# EAGLE design openSX70-usb-charger (EAGLE 9.2.0)
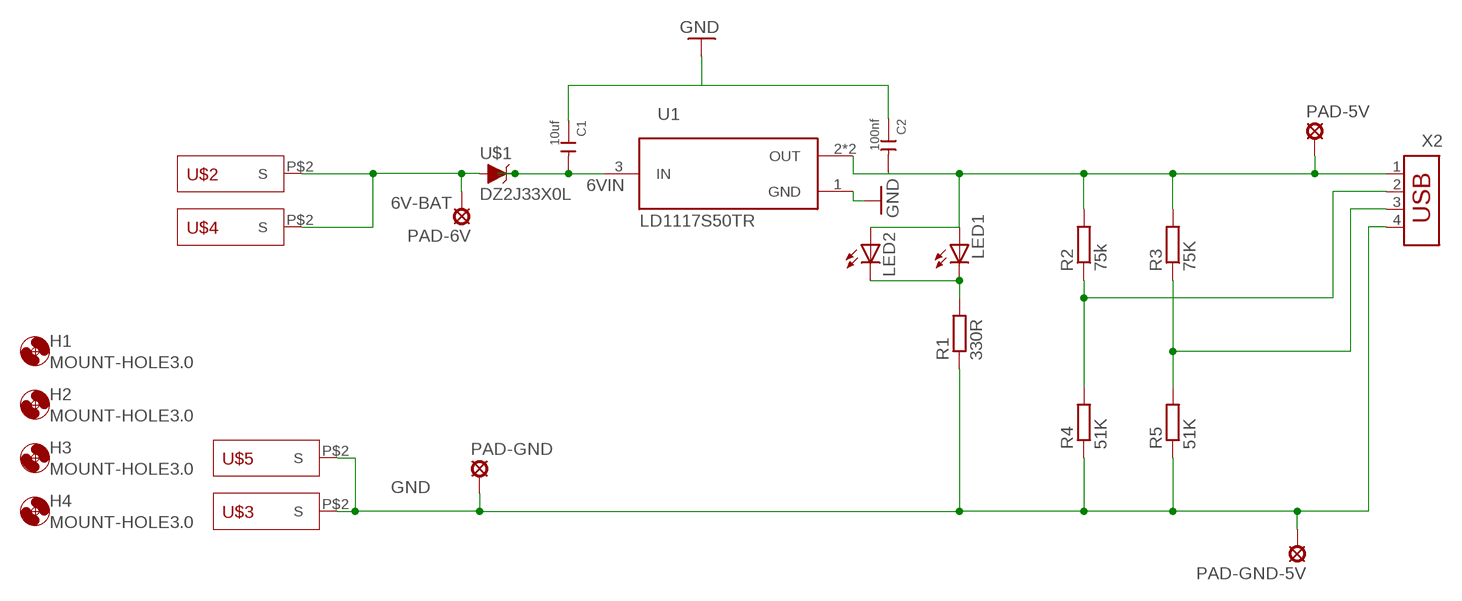
[diagram p0: schematic, sheet 1]

## Parts
C1  10uf  CERAMIC-10UF-10V-10%-X5R(0603)  [C0603]
C2  100nf  CERAMIC-100NF-50V-10%-X7R(0603)  [C0603]
H1  MOUNT-HOLE3.0  [3,0]
H2  MOUNT-HOLE3.0  [3,0]
H3  MOUNT-HOLE3.0  [3,0]
H4  MOUNT-HOLE3.0  [3,0]
LED1  LED5MM  [LED5MM]
LED2  LEDCHIPLED_0805  [CHIPLED_0805]
PAD-5V  LSP13  [LSP13]
PAD-6V  LSP13  [LSP13]
PAD-GND  LSP13  [LSP13]
PAD-GND-5V  LSP13  [LSP13]
R1  330R  R-EU_R0603  [R0603]
R2  75k  R-EU_R0603  [R0603]
R3  75K  R-EU_R0603  [R0603]
R4  51K  R-EU_R0603  [R0603]
R5  51K  R-EU_R0603  [R0603]
U1  LD1117S50TR  [LD1117S50TR_SOT230P700X180-4N]
U$1  DZ2J33X0L  [SMINI2]
U$2  BATTERY-PAD  [BATTERY-PAD]
U$3  BATTERY-PAD  [BATTERY-PAD]
U$4  BATTERY-PAD  [BATTERY-PAD]
U$5  BATTERY-PAD  [BATTERY-PAD]
X2  USB-787616  [USB]

## Nets
6V-BAT: PAD-6V.MP U$1.P$2(A) U$2.P$2(S) U$4.P$2(S)
6VIN: C1.2 U1.3(IN) U$1.P$1(C)
GND: C1.1 C2.1 PAD-GND-5V.MP PAD-GND.MP R1.1 R4.1 R5.1 U1.1(GND) U$3.P$2(S) U$5.P$2(S) X2.4
N$1: LED1.K(C) LED2.C R1.2
N$2: C2.2 LED1.A LED2.A PAD-5V.MP R2.2 R3.2 U1.2(OUT) U1.4(OUT) X2.1
N$3: R2.1 R4.2 X2.2
N$5: R3.1 R5.2 X2.3

## Library data of the parts
C1 = Seeed-Capacitor:CERAMIC-10UF-10V-10%-X5R(0603): 302010103; MPN: CC0603KRX5R6BB106
C2 = Seeed-Capacitor:CERAMIC-100NF-50V-10%-X7R(0603): 302010138; MPN: CC0603KRX7R9BB104
H1-H4 = holes:MOUNT-HOLE: MOUNTING HOLE with drill center marker
LED1 LED2 = led:LED: LED OSRAM: - CHIPLED LG R971, LG N971, LY N971, LG Q971, LY Q971, LO R971, LY R971 LH N974, LH R974 LS Q976, LO Q976, LY Q976 LO Q996 - Hyper CHIPLED LW Q18S LB Q993, LB Q99A, LB R99A - SideLED LS A670, LO A670, LY A670, LG A670, LP A670 LB A673, LV A673, LT A673, LW A673 LH A674 LY A675 LS A676, LA A676, LO A676, LY A676, LW A676 LS A679, LY A679, LG A679 - Hyper Micro SIDELED® LS Y876, LA Y876, LO Y876, LY Y876 LT Y87S - SmartLED LW L88C, LW L88S LB L89C, LB L89S, LG L890 LS L89K, LO L89K, LY L89K LS L896, LA L896, LO L896, LY L896 - TOPLED LS T670, LO T670, LY T670, LG T670, LP T670 LSG T670, LSP T670, LSY T670, LOP T670, LYG T670 LG T671, LOG T671, LSG T671 LB T673, LV T673, LT T673, LW T673 LH T674 LS T676, LA T676, LO T676, LY T676, LB T676, LH T676, LSB T676, LW T676 LB T67C, LV T67C, LT T67C, LS T67K, LO T67K, LY T67K, LW E67C LS E67B, LA E67B, LO E67B, LY E67B, LB E67C, LV E67C, LT E67C LW T67C LS T679, LY T679, LG T679 LS T770, LO T770, LY T770, LG T770, LP T770 LB T773, LV T773, LT T773, LW T773 LH T774 LS E675, LA E675, LY E675, LS T675 LS T776, LA T776, LO T776, LY T776, LB T776 LHGB T686 LT T68C, LB T68C - Hyper Mini TOPLED® LB M676 - Mini TOPLED Santana® LG M470 LS M47K, LO M47K, LY M47K Source: http://www.osram.convergy.de LUXEON: - LUMILED® LXK2-PW12-R00, LXK2-PW12-S00, LXK2-PW14-U00, LXK2-PW14-V00 LXK2-PM12-R00, LXK2-PM12-S00, LXK2-PM14-U00 LXK2-PE12-Q00, LXK2-PE12-R00, LXK2-PE12-S00, LXK2-PE14-T00, LXK2-PE14-U00 LXK2-PB12-K00, LXK2-PB12-L00, LXK2-PB12-M00, LXK2-PB14-N00, LXK2-PB14-P00, LXK2-PB14-Q00 LXK2-PR12-L00, LXK2-PR12-M00, LXK2-PR14-Q00, LXK2-PR14-R00 LXK2-PD12-Q00, LXK2-PD12-R00, LXK2-PD12-S00 LXK2-PH12-R00, LXK2-PH12-S00 LXK2-PL12-P00, LXK2-PL12-Q00, LXK2-PL12-R00 Source: www.luxeon.com KINGBRIGHT: KA-3528ASYC Source: www.kingbright.com
PAD-5V PAD-6V PAD-GND PAD-GND-5V = solpad:LSP13: SOLDER PAD drill 1.3 mm, distributor Buerklin, 12H562
R1-R5 = resistor:R-EU_: RESISTOR, European symbol
U1 = Common-Parts-Library-Eagle:LD1117S50TR: LDO Voltage Regulators 3.3V 0.8A Positive; MANUFACTURER: ST Microelectronics
U$1 = _openSX70:DZ2J33X0L
U$2-U$5 = _openSX70:BATTERY-PAD
X2 = con-amp:USB-787616: AMP connector

## Board
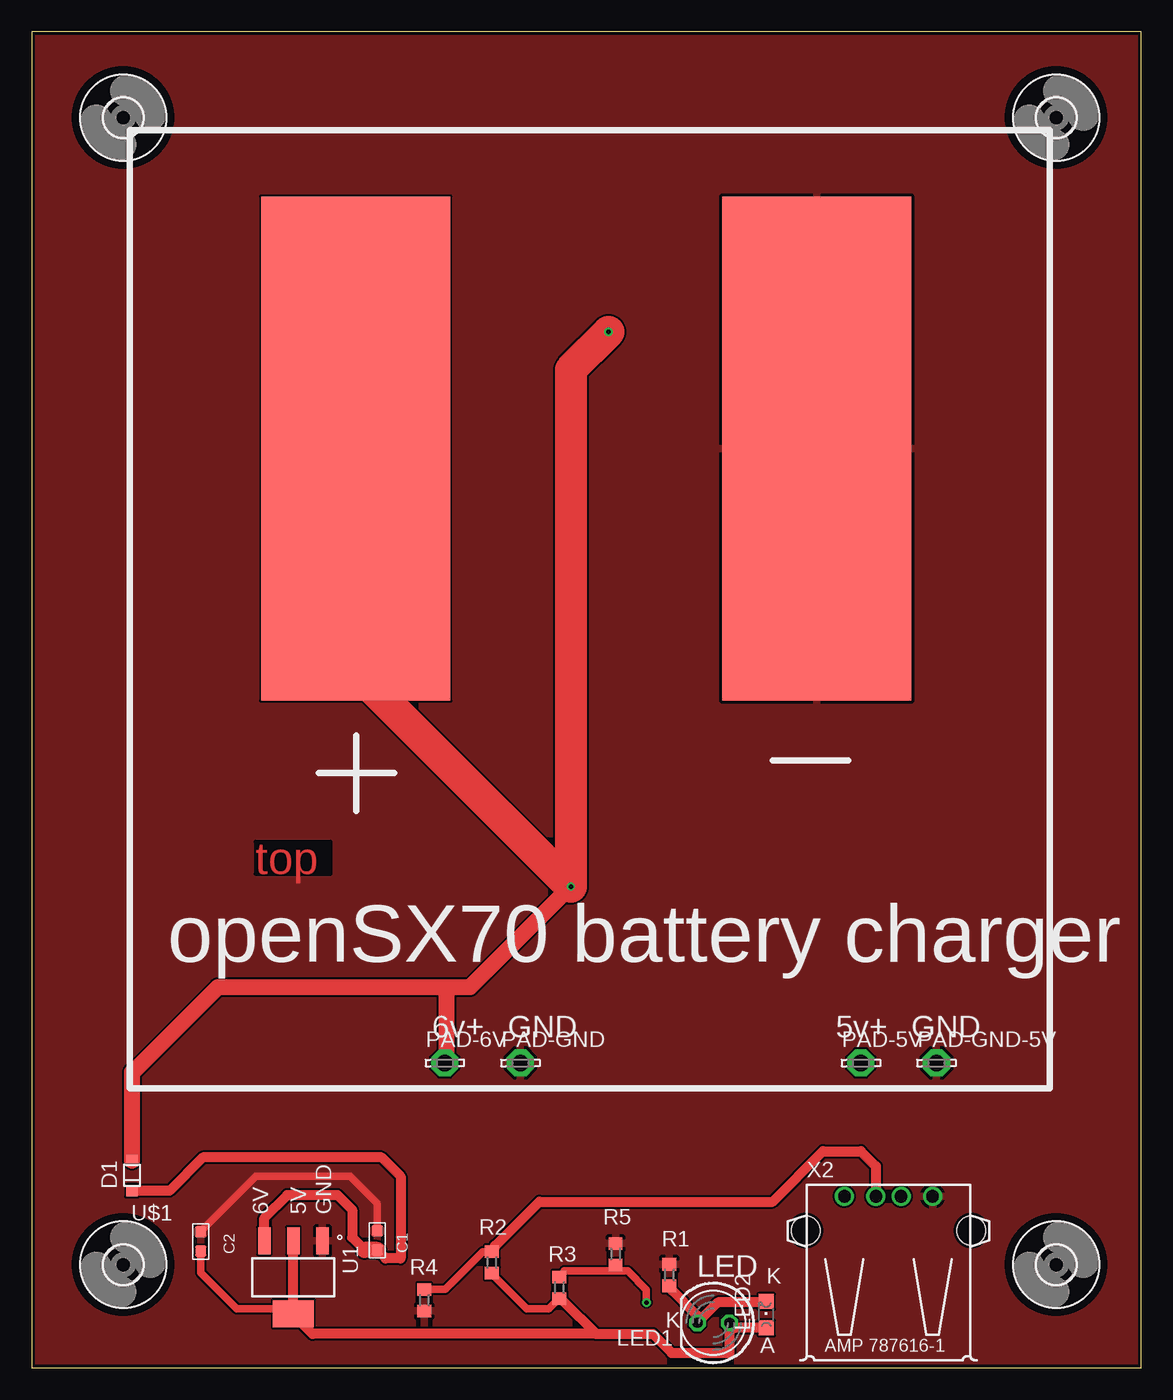
[diagram p1: board, top side]
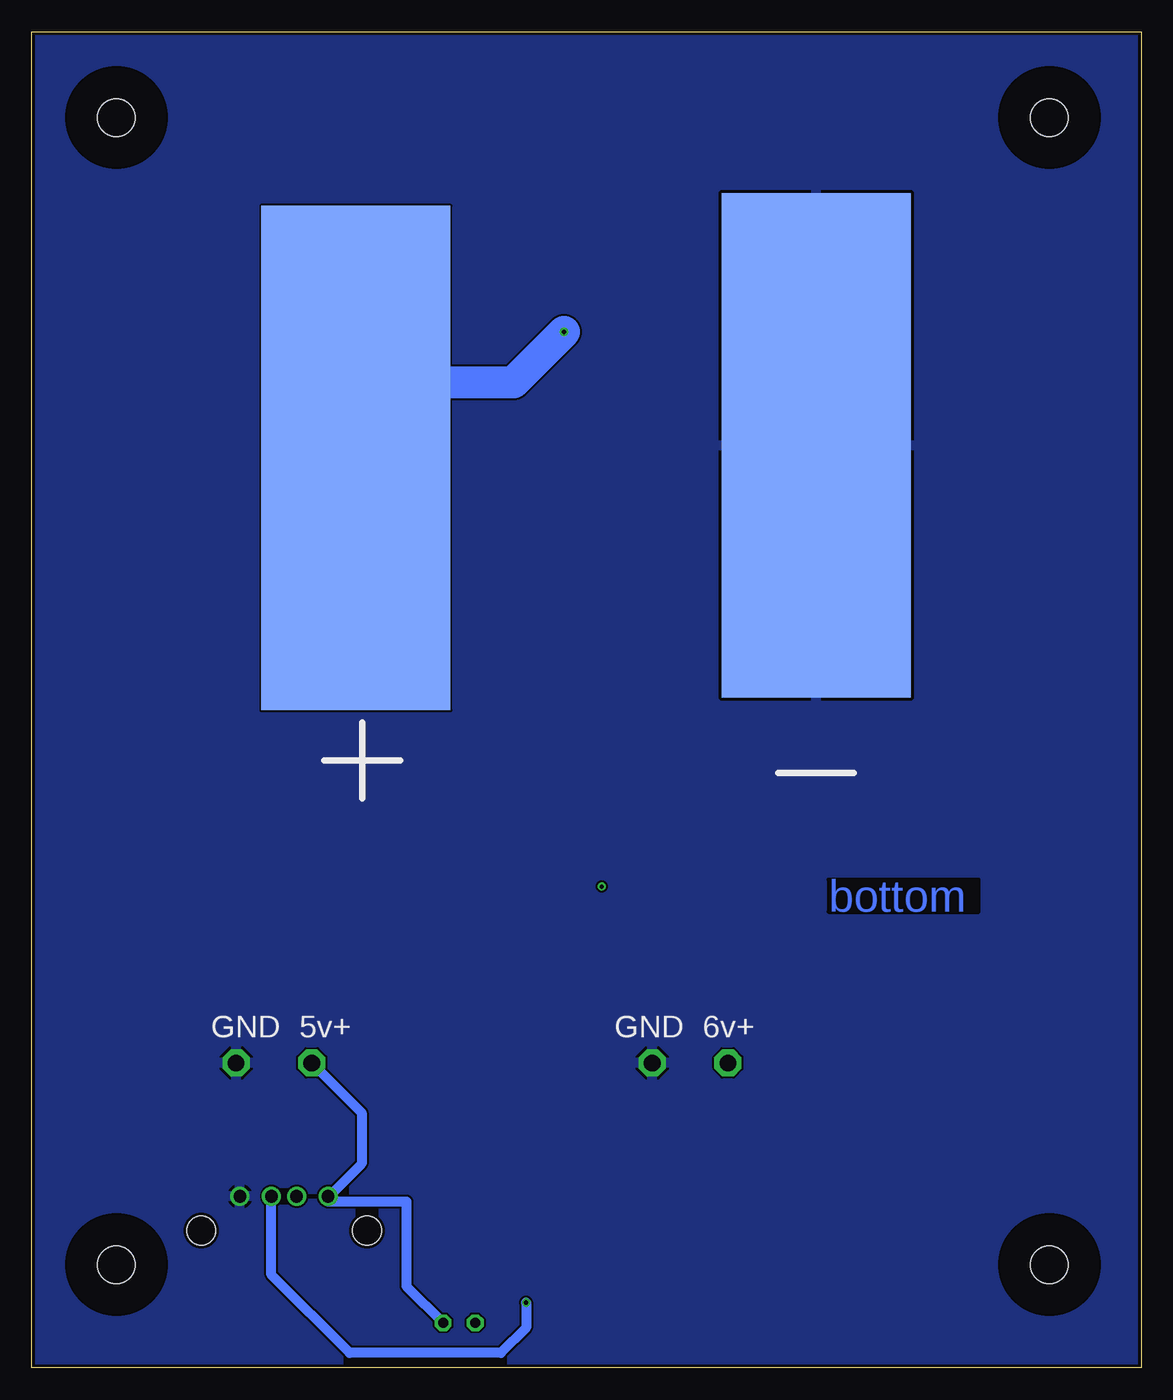
[diagram p2: board, bottom side, seen from below]

Size 88 x 106.04 mm. Coordinates in mm from the lower left corner, seen from the top.
Outline: 0,0 88,0 88,106.04 0,106.04 0,0
Copper layers (1*16): Top 0.035mm / dielectric 1.5mm / Bottom 0.035mm
Design rules "SeeedStudio_2layer_DRU_no_angle_20140221": minimum track width 6mil, minimum drill 12mil, track to track 6mil, track to pad 6mil, pad to pad 6mil, via to via 6mil, smd to smd 0mil, copper to edge 10mil, drill to drill 10mil, minimum pad ring 10mil, minimum via ring 6mil, stop-mask expansion 2mil, vias tented up to drill 100mil, thermal gap 10mil

### Footprints (pad centres in the part's own frame; a part is rotated, then mirrored left to right if it is on the bottom)
C0603 = smd 0.889 x 0.889: 1 0,0.762; 2 0,-0.762
3,0 = hole 3: 0,0
LED5MM = drill 0.813 octagon: A -1.27,0; K 1.27,0
CHIPLED_0805 = smd 1.2 x 1.2: A 0,-1.05; C 0,1.05
LSP13 = drill 1.321 pad 2.159 octagon: MP 0,0
R0603 = smd 1 x 1.1: 1 -0.85,0; 2 0.85,0
LD1117S50TR_SOT230P700X180-4N = smd 2.15 x 1: 1 -2.9,2.3; 2 -2.9,0; 3 -2.9,-2.3 | smd 2.15 x 3.25: 4 2.9,0
SMINI2 = smd 0.9 x 0.9: P$1 0,1.511; P$2 0,-0.889
BATTERY-PAD = smd 15 x 40: P$2 0,0
USB = drill 1: 1 -3.5,12.99; 2 -1,12.99; 3 1,12.99; 4 3.5,12.99 | hole 2.3: -6.57,10.28; 6.57,10.28

### Placement (x,y rotation side)
C1  27.42,10.12 0 top
C2  13.42,10.04 0 top
H1  7.27,8.2 0 top
H2  81.27,8.2 0 top
H3  81.27,99.2 0 top
H4  7.27,99.2 0 top
LED1  54.08,3.58 180 top
LED2  58.27,4.23 0 top
PAD-5V  65.77,24.2 0 top
PAD-6V  32.77,24.2 0 top
PAD-GND  38.77,24.2 0 top
PAD-GND-5V  71.77,24.2 0 top
R1  50.58,7.38 270 top
R2  36.51,8.38 270 top
R3  41.87,6.38 270 top
R4  31.15,5.38 90 top
R5  46.32,9.03 270 top
U1  20.77,7.2 270 top
U$1  7.96,15.58 180 top
U$2  25.71,72.94 0 top
U$3  62.27,72.94 0 top
U$4  62.27,72.2 0 bottom
U$5  25.77,73.2 0 bottom
X2  67.97,0.63 0 top

### Tracks (layer width: path | path; a pad name or v marks a point on that pad's centre or on a via)
6V-BAT  (via drill 0.35)
  Top 0.152: 32.91,24.35 PAD-6V.MP
  Top 1.27: v42.77,38.2 34.77,30.2 32.91,30.2 | 32.91,30.2 14.77,30.2 8,23.43 7.96,23.47 U$1.P$2 | 32.91,30.2 32.91,24.35
  Top 2.54: v45.77,82.2 42.77,79.2 v42.77,38.2 25.71,55.26 U$2.P$2
  Bottom 0.152: U$4.P$2 62.32,72.35 62.32,77.08 62.27,78.2
  Bottom 2.54: 62.27,78.2 49.77,78.2 v45.77,82.2
6VIN
  Top 0.813: 26.42,9.36 25.42,10.36 25.42,12.55 24.27,13.7 20.27,13.7 18.47,11.9 U1.3 | C1.2 28.08,8.7 29.27,8.7 29.27,15.2 27.77,16.7 13.59,16.7 10.96,14.07 U$1.P$1
  Top 1.27: C1.2 26.42,9.36
GND
  Top 0.152: 27.42,13 27.38,13.09
  Top 0.61: 27.38,13.09 25.27,15.2 17.77,15.2 13.77,11.2 C2.1 | 27.42,13 C1.1
  Bottom 0.152: 25.9,73.11 U$5.P$2 | 38.7,24.35 PAD-GND.MP
  pour Top: -0.23,106.2 87.77,106.2 87.77,-0.8 -0.23,-0.8 -0.23,0.2
  pour Bottom: 0.77,106.2 87.77,106.2 87.77,0.2 -0.23,0.2 -0.23,106.2
N$1
  Top 0.152: LED2.C 58.27,5.2
  Top 0.61: 50.77,6.2 R1.2
  Top 0.813: 58.27,5.2 54.43,5.2 LED1.K 52.81,4.16 50.77,6.2
N$2
  Top 0.152: 20.77,4.7 U1.4 20.77,4.2 | 36.77,7.2 R2.2
  Top 0.61: C2.2 13.42,7.55 16.27,4.7 20.77,4.7 | 36.77,7.2 39.27,4.7 41.04,4.7 R3.2 42.27,5.2
  Top 0.813: 20.77,4.7 U1.2 | 44.77,2.7 42.27,5.2 | 20.77,4.2 22.27,2.7 44.77,2.7 | 44.77,2.7 49.27,2.7 50.77,1.2 55.35,1.2 LED1.A 55.75,3.18 LED2.A
  Bottom 0.61: 64.47,13.56 X2.1 64.48,13.2
  Bottom 0.813: 64.48,13.2 58.27,13.2 58.27,6.5 LED1.A | 64.47,13.56 61.83,16.2 61.83,20.26 PAD-5V.MP
N$3
  Top 0.152: 36.27,9.2 R2.1
  Top 0.61: R4.2 32.8,6.23 35.77,9.2 36.27,9.2
  Top 0.813: R2.1 36.77,9.7 40.27,13.2 58.77,13.2 62.77,17.2 65.77,17.2 66.97,16 X2.2
N$5  (via drill 0.35)
  Top 0.61: 46.27,7.7 42.27,7.7 R3.1 | 46.27,7.7 R5.2 | v48.77,5.2 48.77,6.2 47.27,7.7 46.27,7.7
  Bottom 0.813: v48.77,5.2 48.77,3.2 50.77,1.2 62.77,1.2 68.97,7.4 X2.3

### Text on the board
Top: top
Bottom: bottom
tNames: openSX70 battery charger | 6v+ | GND | 5v+ | GND | D1 | 6V | 5V | GND | LED | K | K | A
bNames: 6v+ | GND | 5v+ | GND